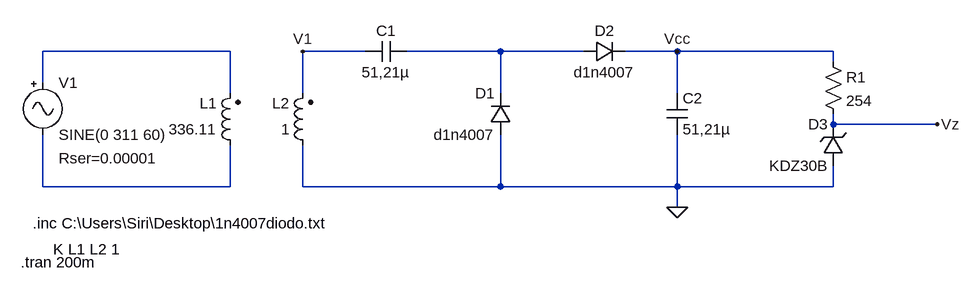
[diagram p0: schematic SimulacaoRelatorio3Parte2.asc]
SimulacaoRelatorio3Parte2.asc, the LTspice schematic file:
Version 4
SHEET 1 1548 680
WIRE 416 -32 128 -32
WIRE 624 -32 528 -32
WIRE 832 -32 688 -32
WIRE 960 -32 832 -32
WIRE 1104 -32 1024 -32
WIRE 1344 -32 1104 -32
WIRE 1344 -16 1344 -32
WIRE 128 16 128 -32
WIRE 416 32 416 -32
WIRE 528 32 528 -32
WIRE 832 32 832 -32
WIRE 1104 32 1104 -32
WIRE 1344 80 1344 64
WIRE 1504 80 1344 80
WIRE 128 176 128 96
WIRE 416 176 416 112
WIRE 416 176 128 176
WIRE 528 176 528 112
WIRE 832 176 832 96
WIRE 832 176 528 176
WIRE 1104 176 1104 96
WIRE 1104 176 832 176
WIRE 1344 176 1344 144
WIRE 1344 176 1104 176
WIRE 1104 208 1104 176
FLAG 1104 -32 Vcc
FLAG 1104 208 0
FLAG 528 -32 V1
FLAG 1504 80 Vz
SYMBOL Misc\\signal 128 0 R0
WINDOW 123 0 0 Left 0
WINDOW 39 24 132 Left 2
SYMATTR InstName V1
SYMATTR Value SINE(0 311 60)
SYMATTR SpiceLine Rser=0.00001
SYMBOL ind2 432 128 R180
WINDOW 0 36 80 Left 2
WINDOW 3 36 40 Left 2
SYMATTR InstName L1
SYMATTR Value 336.11
SYMATTR Type ind
SYMBOL ind2 544 128 R180
WINDOW 0 36 80 Left 2
WINDOW 3 36 40 Left 2
SYMATTR InstName L2
SYMATTR Value 1
SYMATTR Type ind
SYMBOL cap 688 -48 R90
WINDOW 0 0 32 VBottom 2
WINDOW 3 32 32 VTop 2
SYMATTR InstName C1
SYMATTR Value 51,21µ
SYMBOL diode 848 96 R180
WINDOW 0 24 64 Left 2
WINDOW 3 24 0 Left 2
SYMATTR InstName D1
SYMATTR Value d1n4007
SYMBOL diode 960 -16 R270
WINDOW 0 32 32 VTop 2
WINDOW 3 0 32 VBottom 2
SYMATTR InstName D2
SYMATTR Value d1n4007
SYMBOL cap 1088 32 R0
SYMATTR InstName C2
SYMATTR Value 51,21µ
SYMBOL res 1328 -32 R0
SYMATTR InstName R1
SYMATTR Value 254
SYMBOL zener 1360 144 R180
WINDOW 0 24 64 Left 2
WINDOW 3 24 0 Left 2
SYMATTR InstName D3
SYMATTR Value KDZ30B
TEXT 112 232 Left 2 !.inc C:\\Users\\Siri\\Desktop\\1n4007diodo.txt
TEXT 144 272 Left 2 !K L1 L2 1
TEXT 94 292 Left 2 !.tran 200m

The netlist it stands for:
* SimulacaoRelatorio3Parte2.asc
V1 N001 N003 SINE(0 311 60) Rser=0.00001
L1 N003 N001 336.11
L2 0 V1 1
C1 N002 V1 51,21µ
D1 0 N002 d1n4007
D2 N002 Vcc d1n4007
C2 Vcc 0 51,21µ
R1 Vcc Vz 254
D3 0 Vz KDZ30B
.model D D
.lib standard.dio
.inc C:\Users\Siri\Desktop\1n4007diodo.txt
K L1 L2 1
.tran 200m
.backanno
.end